# Altium schematic sheet FMB-MOTOR.SchDoc
size A4
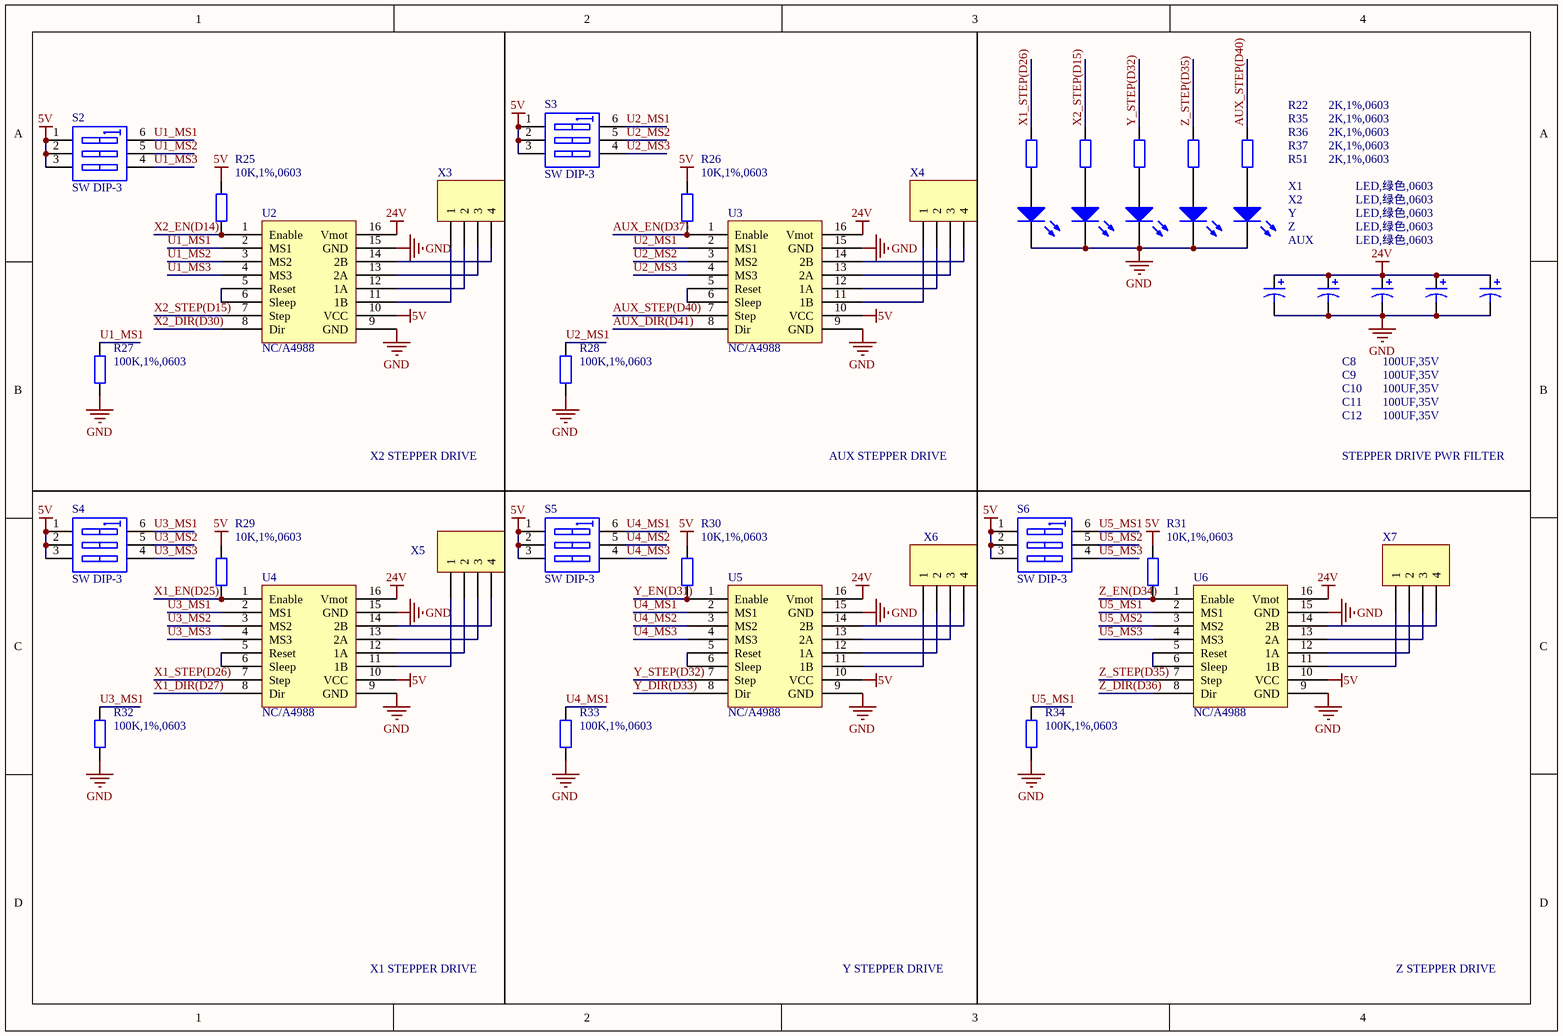
[diagram p0: FMB-MOTOR.SchDoc]

## Parts
AUX  LED,绿色,0603  [LED-0603]
C8  100UF,35V  [EC-5X5.3]
C9  100UF,35V  [EC-5X5.3]
C10  100UF,35V  [EC-5X5.3]
C11  100UF,35V  [EC-5X5.3]
C12  100UF,35V  [EC-5X5.3]
R22  2K,1%,0603  [RC0603]
R25  10K,1%,0603  [RC0603]
R26  10K,1%,0603  [RC0603]
R27  100K,1%,0603  [RC0603]
R28  100K,1%,0603  [RC0603]
R29  10K,1%,0603  [RC0603]
R30  10K,1%,0603  [RC0603]
R31  10K,1%,0603  [RC0603]
R32  100K,1%,0603  [RC0603]
R33  100K,1%,0603  [RC0603]
R34  100K,1%,0603  [RC0603]
R35  2K,1%,0603  [RC0603]
R36  2K,1%,0603  [RC0603]
R37  2K,1%,0603  [RC0603]
R51  2K,1%,0603  [RC0603]
S2  SW DIP-3  [DIP-3-SW]
S3  SW DIP-3  [DIP-3-SW]
S4  SW DIP-3  [DIP-3-SW]
S5  SW DIP-3  [DIP-3-SW]
S6  SW DIP-3  [DIP-3-SW]
U2  NC/A4988  [A4988]
U3  NC/A4988  [A4988]
U4  NC/A4988  [A4988]
U5  NC/A4988  [A4988]
U6  NC/A4988  [A4988]
X1  LED,绿色,0603  [LED-0603]
X2  LED,绿色,0603  [LED-0603]
X3  Molex 70543-0038  [DIP-1*4-2.54]  (value not drawn)
X4  Molex 70543-0038  [DIP-1*4-2.54]  (value not drawn)
X5  Molex 70543-0038  [DIP-1*4-2.54]  (value not drawn)
X6  Molex 70543-0038  [DIP-1*4-2.54]  (value not drawn)
X7  Molex 70543-0038  [DIP-1*4-2.54]  (value not drawn)
Y  LED,绿色,0603  [LED-0603]
Z  LED,绿色,0603  [LED-0603]

## Nets
5V: R25.1 R26.1 R29.1 R30.1 R31.1 S2.1(A1) S2.2(A2) S2.3(A3) S3.1(A1) S3.2(A2) S3.3(A3) S4.1(A1) S4.2(A2) S4.3(A3) S5.1(A1) S5.2(A2) S5.3(A3) S6.1(A1) S6.2(A2) S6.3(A3) U2.10(VCC) U3.10(VCC) U4.10(VCC) U5.10(VCC) U6.10(VCC)
24V: C8.1 C9.1 C10.1 C11.1 C12.1 U2.16(Vmot) U3.16(Vmot) U4.16(Vmot) U5.16(Vmot) U6.16(Vmot)
GND: AUX.2(K) C8.2 C9.2 C10.2 C11.2 C12.2 R27.2 R28.2 R32.2 R33.2 R34.2 U2.9(GND) U2.15(GND) U3.9(GND) U3.15(GND) U4.9(GND) U4.15(GND) U5.9(GND) U5.15(GND) U6.9(GND) U6.15(GND) X1.2(K) X2.2(K) Y.2(K) Z.2(K)
AUX_DIR(D41): U3.8(Dir)
AUX_EN(D37): R26.2 U3.1(Enable)
AUX_STEP(D40): R51.1 U3.7(Step)
U1_MS1: R27.1 S2.6(B1) U2.2(MS1)
U1_MS2: S2.5(B2) U2.3(MS2)
U1_MS3: S2.4(B3) U2.4(MS3)
U2_MS1: R28.1 S3.6(B1) U3.2(MS1)
U2_MS2: S3.5(B2) U3.3(MS2)
U2_MS3: S3.4(B3) U3.4(MS3)
U3_MS1: R32.1 S4.6(B1) U4.2(MS1)
U3_MS2: S4.5(B2) U4.3(MS2)
U3_MS3: S4.4(B3) U4.4(MS3)
U4_MS1: R33.1 S5.6(B1) U5.2(MS1)
U4_MS2: S5.5(B2) U5.3(MS2)
U4_MS3: S5.4(B3) U5.4(MS3)
U5_MS1: R34.1 S6.6(B1) U6.2(MS1)
U5_MS2: S6.5(B2) U6.3(MS2)
U5_MS3: S6.4(B3) U6.4(MS3)
X1_DIR(D27): U4.8(Dir)
X1_EN(D25): R29.2 U4.1(Enable)
X1_STEP(D26): R22.1 U4.7(Step)
X2_DIR(D30): U2.8(Dir)
X2_EN(D14): R25.2 U2.1(Enable)
X2_STEP(D15): R35.1 U2.7(Step)
Y_DIR(D33): U5.8(Dir)
Y_EN(D31): R30.2 U5.1(Enable)
Y_STEP(D32): R36.1 U5.7(Step)
Z_DIR(D36): U6.8(Dir)
Z_EN(D34): R31.2 U6.1(Enable)
Z_STEP(D35): R37.1 U6.7(Step)
NetAUX_1: AUX.1(A) R51.2
NetR22_2: R22.2 X1.1(A)
NetR35_2: R35.2 X2.1(A)
NetR36_2: R36.2 Y.1(A)
NetR37_2: R37.2 Z.1(A)
NetU2_5: U2.5(Reset) U2.6(Sleep)
NetU2_11: U2.11(1B) X3.1
NetU2_12: U2.12(1A) X3.2
NetU2_13: U2.13(2A) X3.3
NetU2_14: U2.14(2B) X3.4
NetU3_5: U3.5(Reset) U3.6(Sleep)
NetU3_11: U3.11(1B) X4.1
NetU3_12: U3.12(1A) X4.2
NetU3_13: U3.13(2A) X4.3
NetU3_14: U3.14(2B) X4.4
NetU4_5: U4.5(Reset) U4.6(Sleep)
NetU4_11: U4.11(1B) X5.1
NetU4_12: U4.12(1A) X5.2
NetU4_13: U4.13(2A) X5.3
NetU4_14: U4.14(2B) X5.4
NetU5_5: U5.5(Reset) U5.6(Sleep)
NetU5_11: U5.11(1B) X6.1
NetU5_12: U5.12(1A) X6.2
NetU5_13: U5.13(2A) X6.3
NetU5_14: U5.14(2B) X6.4
NetU6_5: U6.5(Reset) U6.6(Sleep)
NetU6_11: U6.11(1B) X7.1
NetU6_12: U6.12(1A) X7.2
NetU6_13: U6.13(2A) X7.3
NetU6_14: U6.14(2B) X7.4

## Notes on the sheet
- X2 STEPPER DRIVE
- AUX STEPPER DRIVE
- STEPPER DRIVE PWR FILTER
- X1 STEPPER DRIVE
- Y STEPPER DRIVE
- Z STEPPER DRIVE

## Library data of the parts
AUX X1 X2 Y Z = LED0: Typical INFRARED GaAs LED; Published: 8-Jun-2000; LatestRevisionDate: 08-Jul-2005; LatestRevisionNote: Mech Layer 1 removed.; PackageReference: LED-0; Publisher: Altium Limited; PackageDescription: LED; 2 Leads
C8-C12 = Cap Pol3: Polarized Capacitor (Surface Mount); Value: 100pF; Published: 8-Jun-2000; LatestRevisionDate: 29-May-2009; LatestRevisionNote: IPC-7351 Footprint Added.; PackageReference: C0805; Publisher: Altium Limited; PackageDescription: Chip Capacitor
R22 R25-R37 R51 = Res2: Resistor; Value: 1K; Published: 8-Jun-2000; LatestRevisionDate: 17-Jul-2002; LatestRevisionNote: Re-released for DXP Platform.; PackageReference: AXIAL-0.4; Publisher: Altium Limited; PackageDescription: Axial Device, Thru-Hole; 2 Leads; 0.4 in Pin Spacing
S2-S6 = SW DIP-3: DIP Switch, 3 Position, SPST; Published: 24-Mar-1999; LatestRevisionDate: 17-Jul-2002; LatestRevisionNote: Re-released for DXP Platform.; PackageReference: DIP-6; Publisher: Altium Limited; Code_JEDEC: MO-001-AM
U2-U6 = A4988
X3-X7 = Header 4: Header, 4-Pin; LatestRevisionDate: 17-Jul-2002; LatestRevisionNote: Re-released for DXP Platform.; Publisher: Altium Limited